# EAGLE design 8-Bit Register_New (EAGLE 7.5.0)
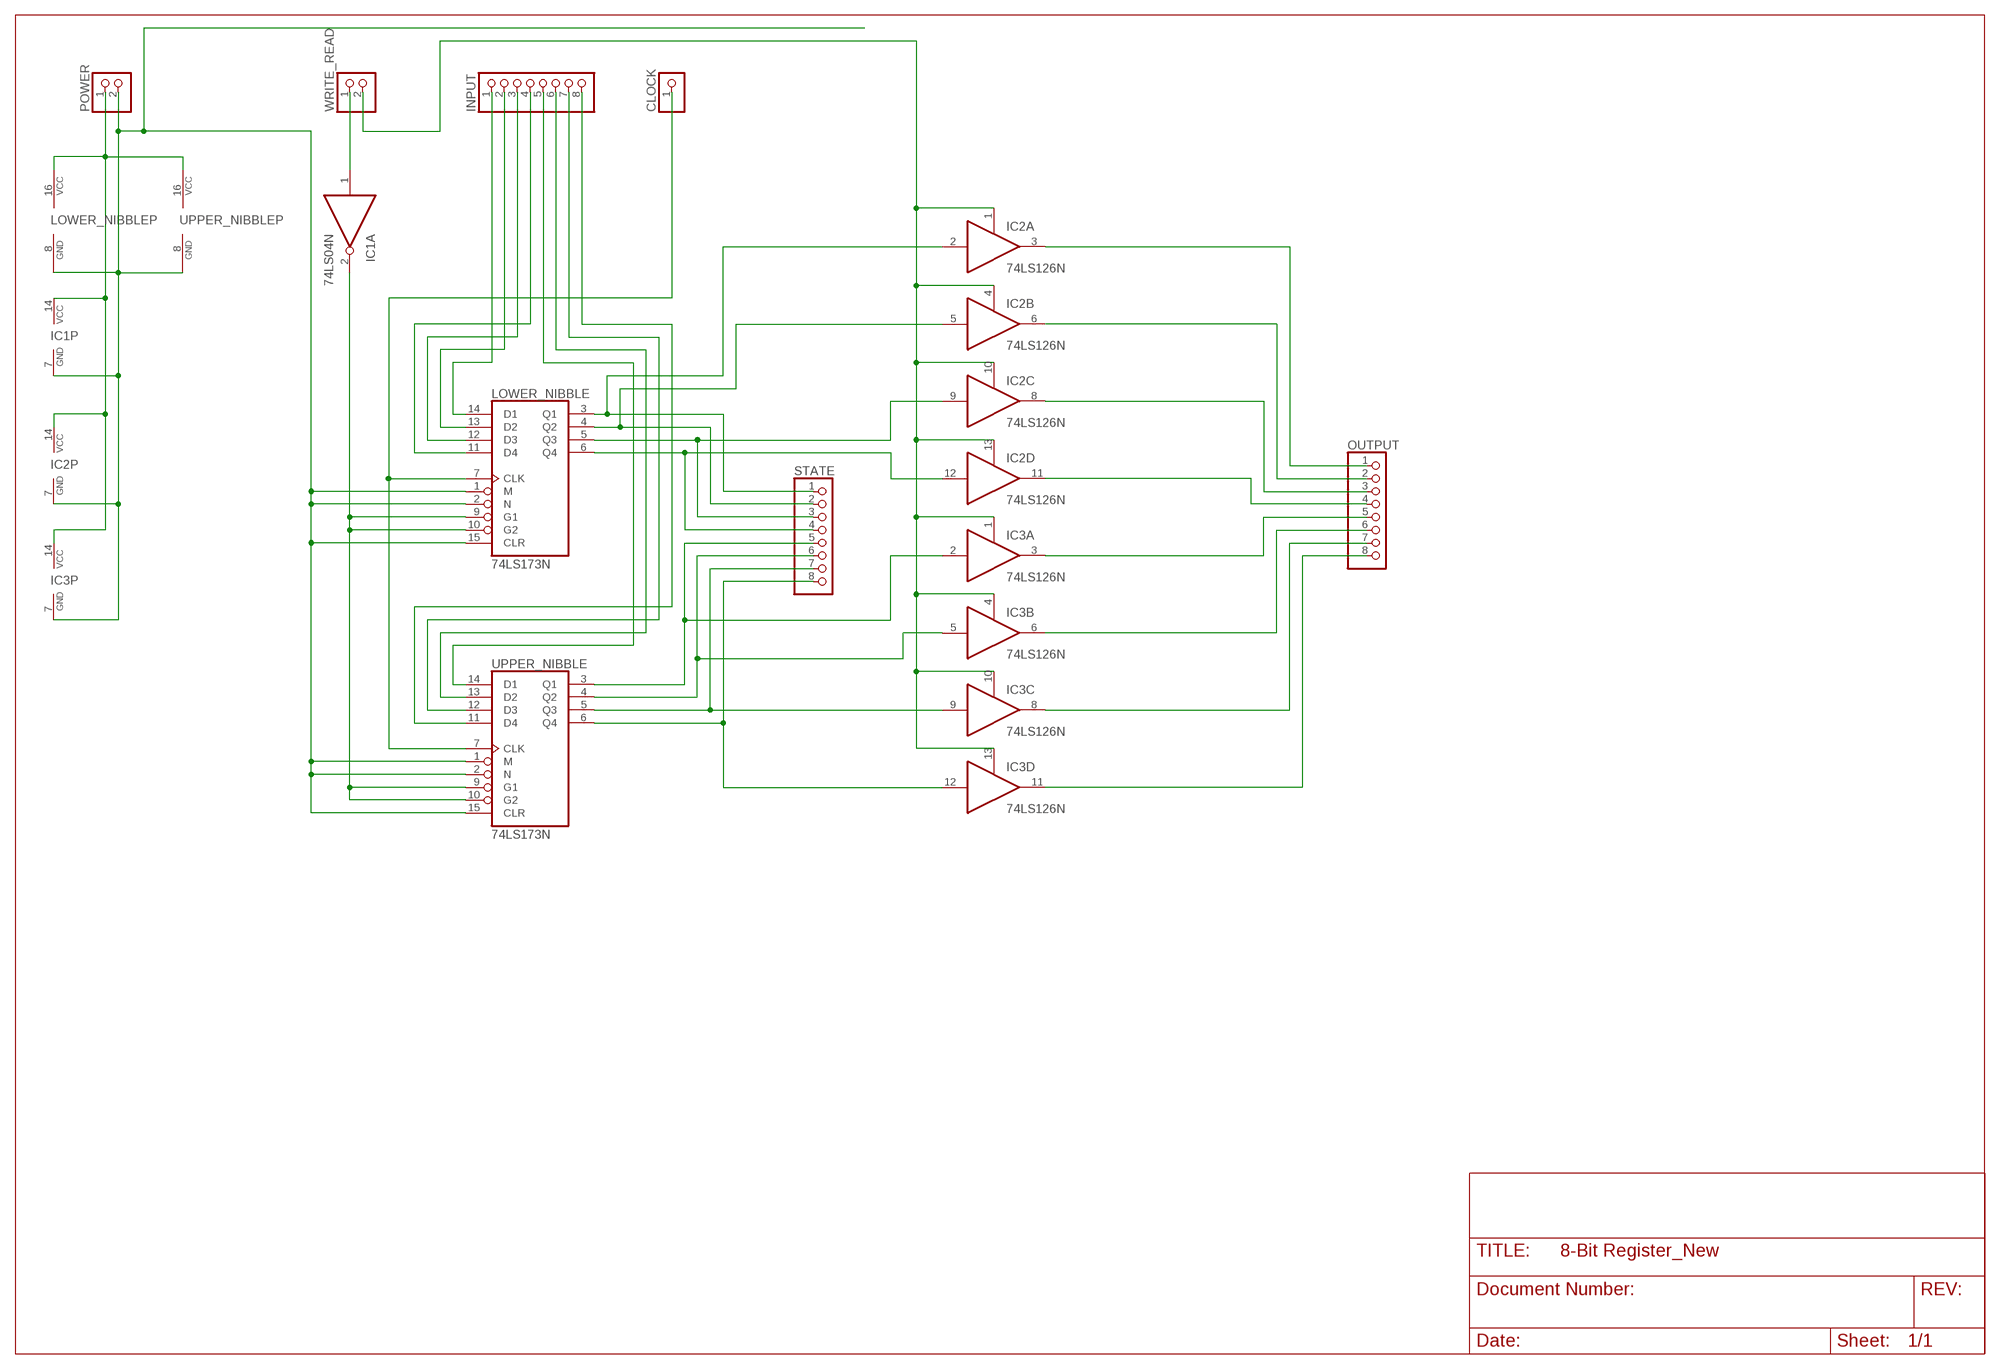
[diagram p0: schematic, sheet 1]

## Parts
CLOCK  PINHD-1X1  [1X01]
IC1  74LS04N  [DIL14]
IC2  74LS126N  [DIL14]
IC3  74LS126N  [DIL14]
INPUT  PINHD-1X8  [1X08]
LOWER_NIBBLE  74LS173N  [DIL16]
OUTPUT  PINHD-1X8  [1X08]
POWER  PINHD-1X2  [1X02]
STATE  PINHD-1X8  [1X08]
UPPER_NIBBLE  74LS173N  [DIL16]
WRITE_READ  PINHD-1X2  [1X02]

## Nets
GND: IC1.7(P:GND) IC2.7(P:GND) IC3.7(P:GND) LOWER_NIBBLE.1(M) LOWER_NIBBLE.2(N) LOWER_NIBBLE.8(GND) LOWER_NIBBLE.15(CLR) POWER.2 UPPER_NIBBLE.1(M) UPPER_NIBBLE.2(N) UPPER_NIBBLE.8(GND) UPPER_NIBBLE.15(CLR)
N$1: IC2.12(D:I) LOWER_NIBBLE.6(Q4) STATE.4
N$2: IC1.1(A:I) WRITE_READ.1
N$3: IC3.9(C:I) STATE.7 UPPER_NIBBLE.5(Q3)
N$11: IC2.11(D:O) OUTPUT.4
N$12: IC1.2(A:O) LOWER_NIBBLE.9(G1) LOWER_NIBBLE.10(G2) UPPER_NIBBLE.9(G1) UPPER_NIBBLE.10(G2)
N$13: CLOCK.1 LOWER_NIBBLE.7(CLK) UPPER_NIBBLE.7(CLK)
N$14: INPUT.1 LOWER_NIBBLE.14(D1)
N$15: INPUT.2 LOWER_NIBBLE.13(D2)
N$16: INPUT.3 LOWER_NIBBLE.12(D3)
N$17: INPUT.4 LOWER_NIBBLE.11(D4)
N$18: INPUT.6 UPPER_NIBBLE.13(D2)
N$19: INPUT.5 UPPER_NIBBLE.14(D1)
N$20: INPUT.7 UPPER_NIBBLE.12(D3)
N$21: INPUT.8 UPPER_NIBBLE.11(D4)
N$22: IC2.2(A:I) LOWER_NIBBLE.3(Q1) STATE.1
N$23: IC2.5(B:I) LOWER_NIBBLE.4(Q2) STATE.2
N$24: IC2.9(C:I) LOWER_NIBBLE.5(Q3) STATE.3
N$26: IC3.2(A:I) STATE.5 UPPER_NIBBLE.3(Q1)
N$27: IC3.5(B:I) STATE.6 UPPER_NIBBLE.4(Q2)
N$29: IC3.12(D:I) STATE.8 UPPER_NIBBLE.6(Q4)
N$30: IC2.1(A:OE) IC2.4(B:OE) IC2.10(C:OE) IC2.13(D:OE) IC3.1(A:OE) IC3.4(B:OE) IC3.10(C:OE) IC3.13(D:OE) WRITE_READ.2
N$31: IC2.3(A:O) OUTPUT.1
N$32: IC2.6(B:O) OUTPUT.2
N$33: IC2.8(C:O) OUTPUT.3
N$35: IC3.3(A:O) OUTPUT.5
N$36: IC3.6(B:O) OUTPUT.6
N$37: IC3.8(C:O) OUTPUT.7
N$38: IC3.11(D:O) OUTPUT.8
VCC: IC1.14(P:VCC) IC2.14(P:VCC) IC3.14(P:VCC) LOWER_NIBBLE.16(VCC) POWER.1 UPPER_NIBBLE.16(VCC)
Unconnected: IC1.3(B:I) IC1.4(B:O) IC1.5(C:I) IC1.6(C:O) IC1.8(D:O) IC1.9(D:I) IC1.10(E:O) IC1.11(E:I) IC1.12(F:O) IC1.13(F:I)

## Library data of the parts
CLOCK = pinhead:PINHD-1X1: PIN HEADER
IC1 = 74xx-eu:74*04: Hex INVERTER
IC2 IC3 = 74xx-eu:74*126: Quad bus BUFFER, 3-state
INPUT OUTPUT STATE = pinhead:PINHD-1X8: PIN HEADER
LOWER_NIBBLE UPPER_NIBBLE = 74xx-us:74*173: 4-bit D type REGISTER, 3-state
POWER WRITE_READ = pinhead:PINHD-1X2: PIN HEADER

## Board
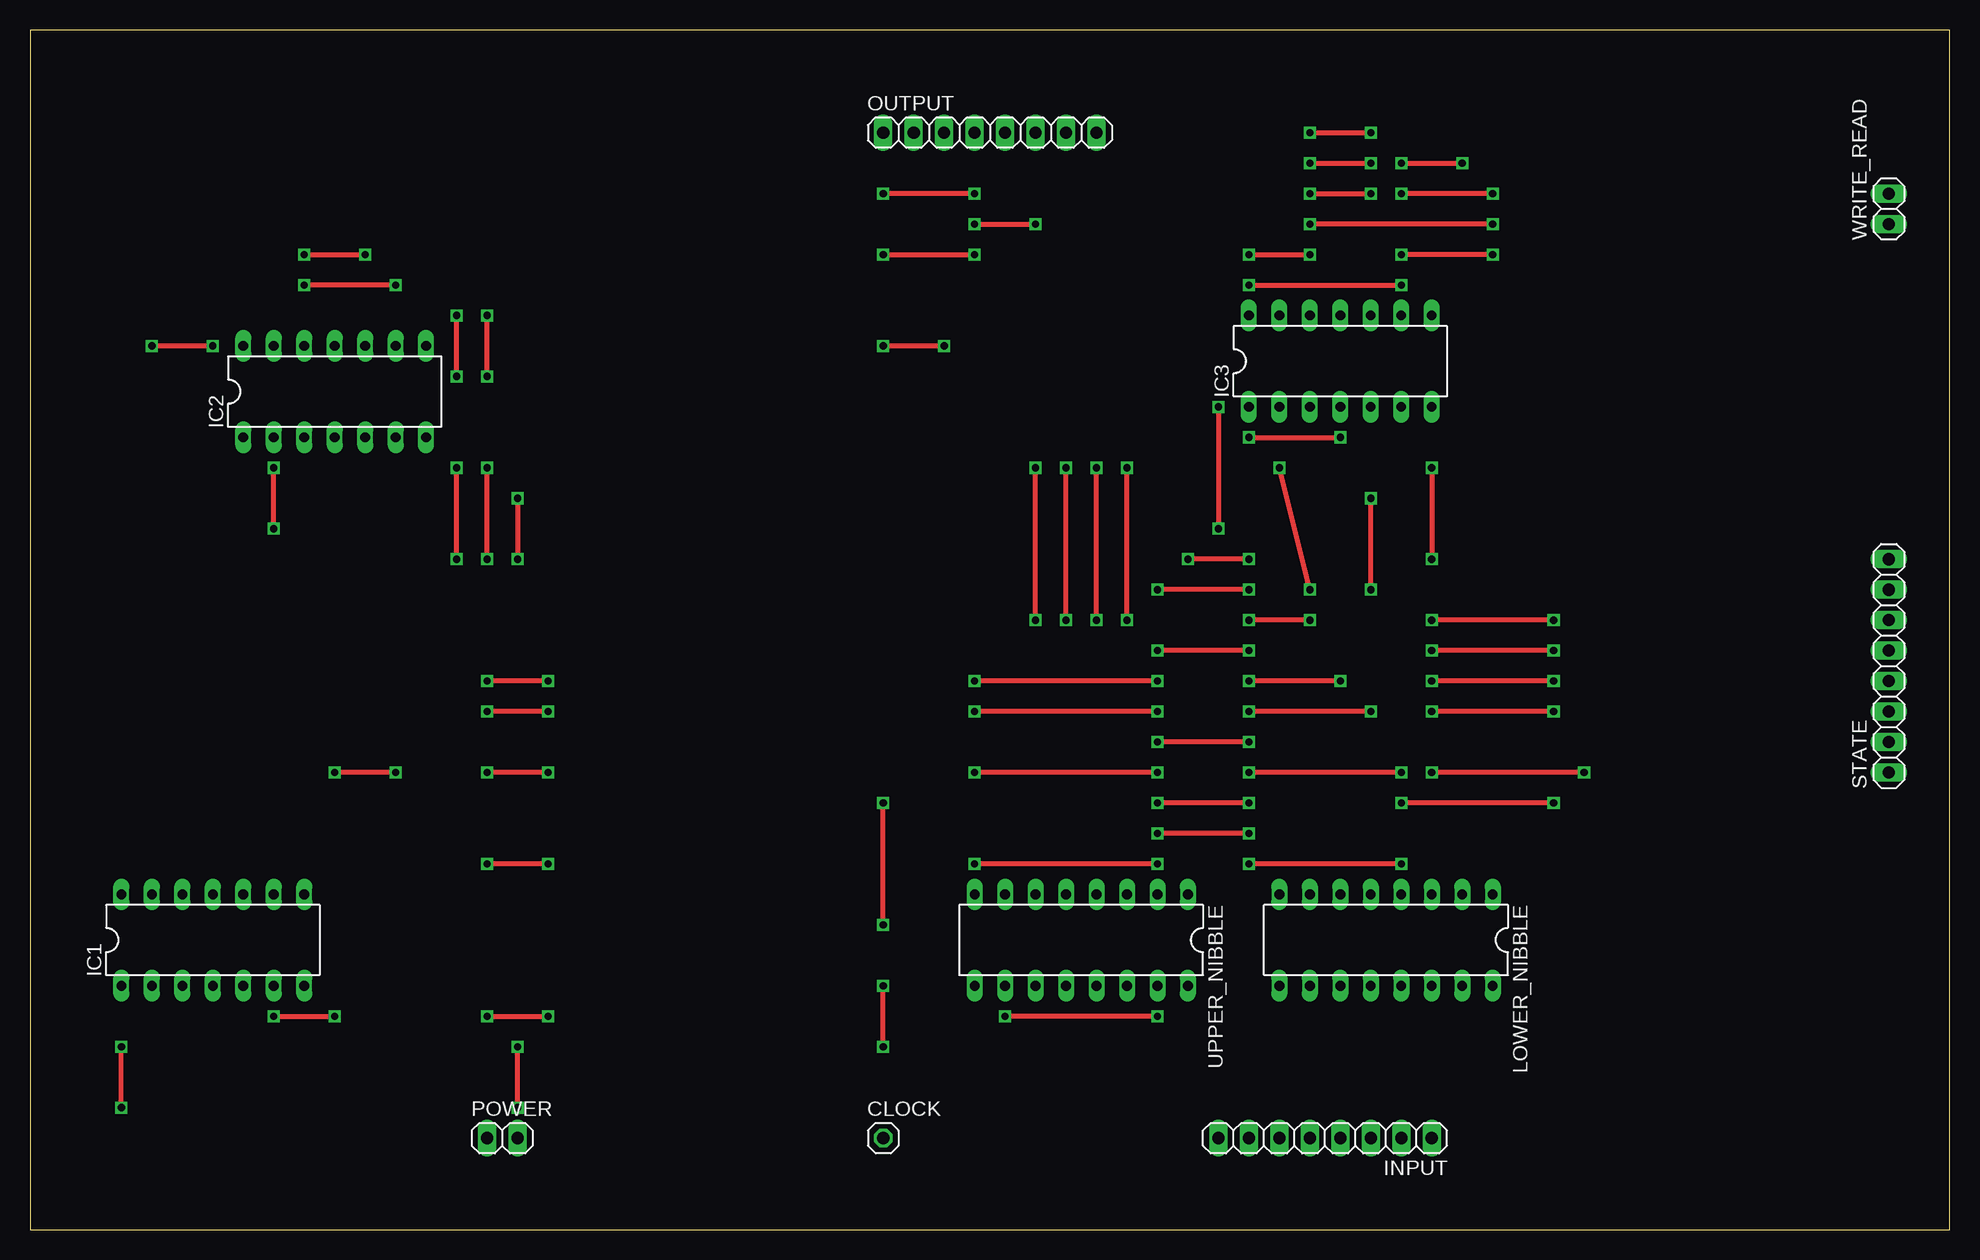
[diagram p1: board, top side]
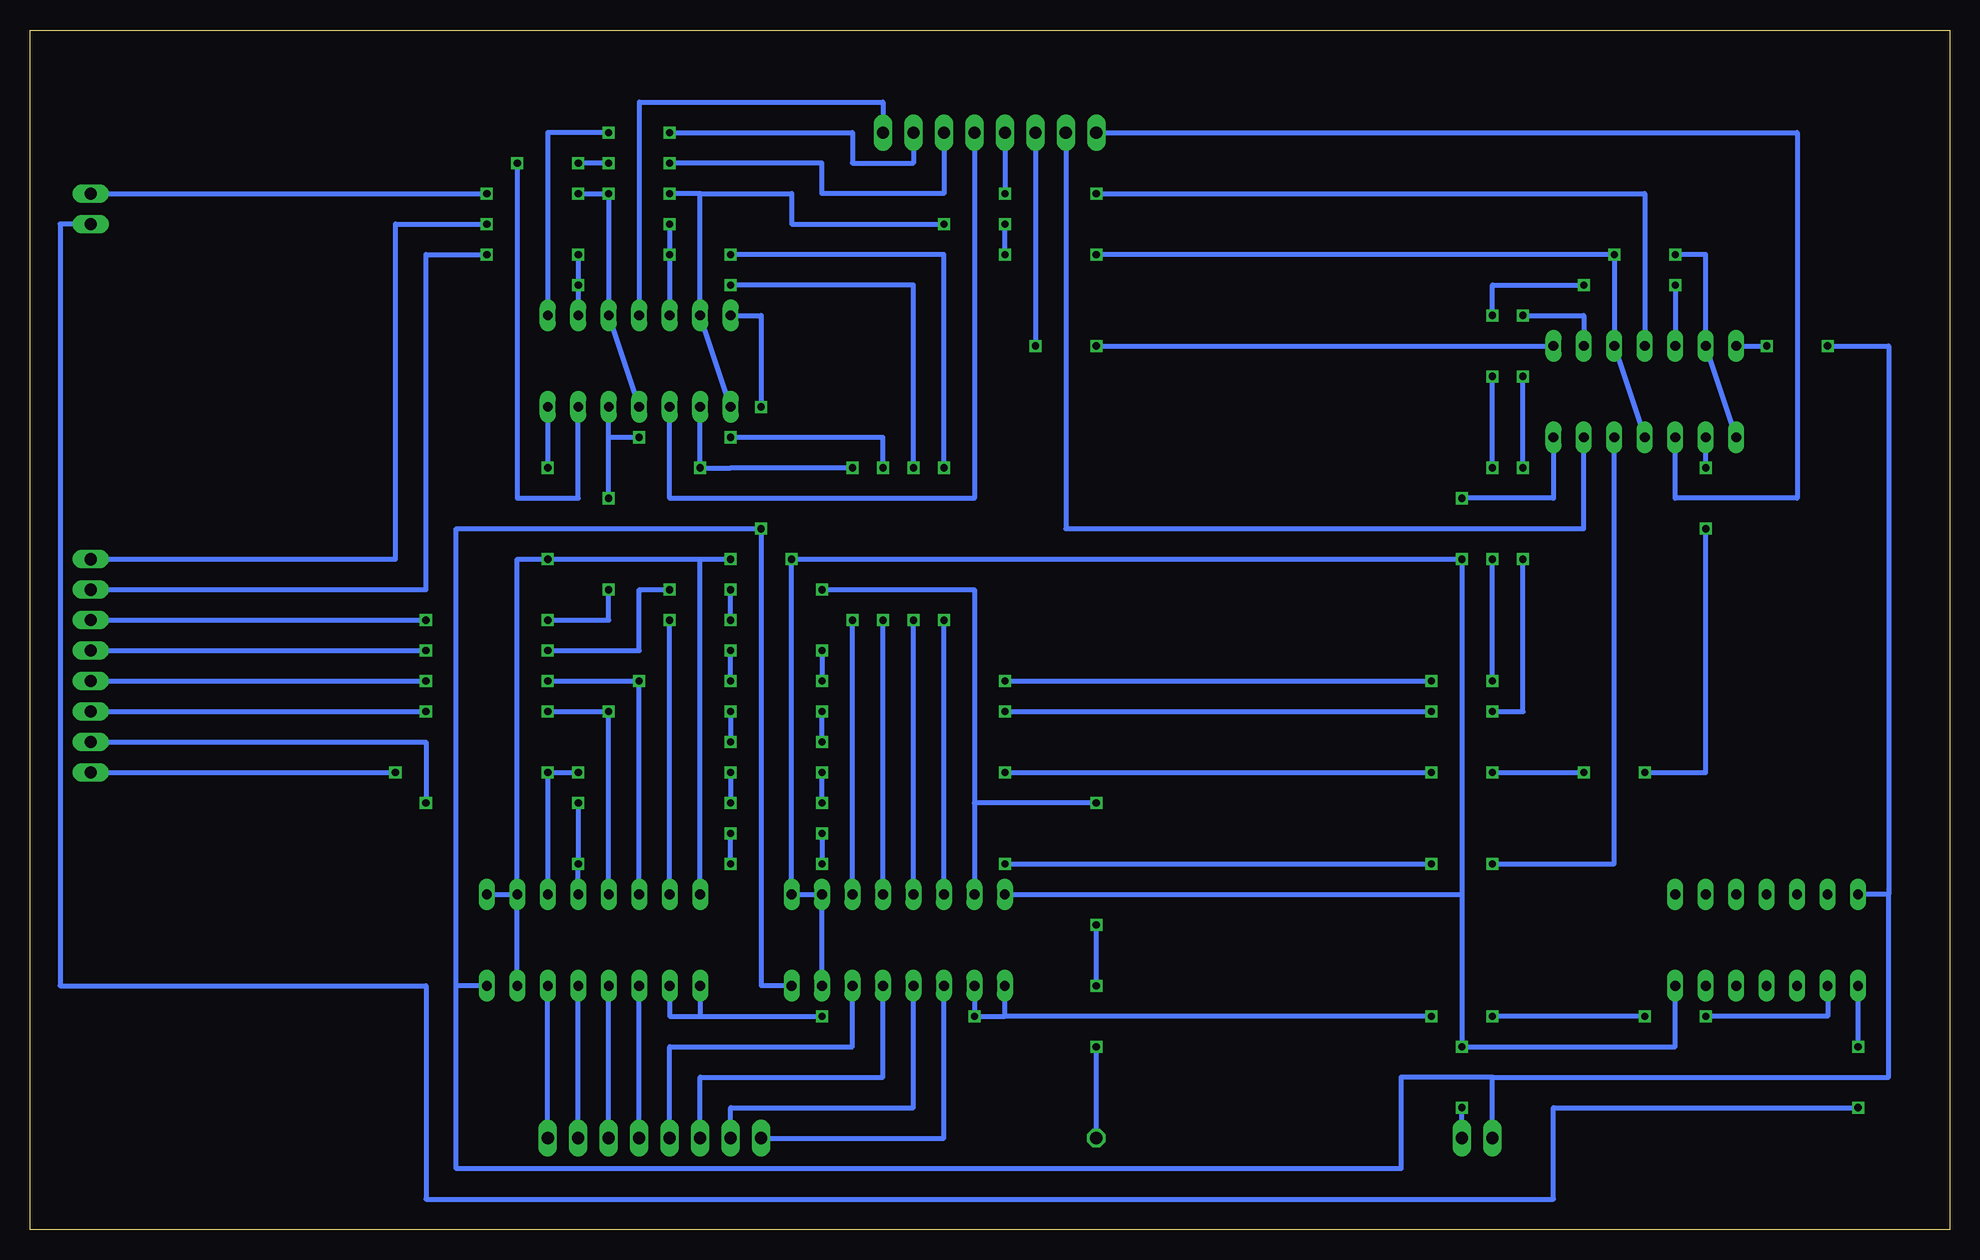
[diagram p2: board, bottom side, seen from below]

Size 160 x 100 mm. Coordinates in mm from the lower left corner, seen from the top.
Outline: 0,0 160,0 160,100 0,100 0,0
Copper layers (1*16): Top 0.035mm / dielectric 1.5mm / Bottom 0.035mm
Design rules "default": minimum track width 10mil, minimum drill 24mil, track to track 8mil, track to pad 8mil, pad to pad 8mil, via to via 8mil, smd to smd 8mil, copper to edge 40mil, drill to drill 8mil, minimum pad ring 10mil, minimum via ring 8mil, stop-mask expansion 4mil, vias tented up to drill 0mil, thermal gap 10mil

### Footprints (pad centres in the part's own frame; a part is rotated, then mirrored left to right if it is on the bottom)
1X01 = drill 1.016 octagon: 1 0,0
DIL14 = drill 0.813 long: 1 -7.62,-3.81; 2 -5.08,-3.81; 3 -2.54,-3.81; 4 0,-3.81; 5 2.54,-3.81; 6 5.08,-3.81; 7 7.62,-3.81; 8 7.62,3.81; 9 5.08,3.81; 10 2.54,3.81; 11 0,3.81; 12 -2.54,3.81; 13 -5.08,3.81; 14 -7.62,3.81
1X08 = drill 1.016 long: 1 -8.89,0; 2 -6.35,0; 3 -3.81,0; 4 -1.27,0; 5 1.27,0; 6 3.81,0; 7 6.35,0; 8 8.89,0
DIL16 = drill 0.813 long: 1 -8.89,-3.81; 2 -6.35,-3.81; 3 -3.81,-3.81; 4 -1.27,-3.81; 5 1.27,-3.81; 6 3.81,-3.81; 7 6.35,-3.81; 8 8.89,-3.81; 9 8.89,3.81; 10 6.35,3.81; 11 3.81,3.81; 12 1.27,3.81; 13 -1.27,3.81; 14 -3.81,3.81; 15 -6.35,3.81; 16 -8.89,3.81
1X02 = drill 1.016 long: 1 -1.27,0; 2 1.27,0

### Placement (x,y rotation side)
CLOCK  71.12,7.62 0 top
IC1  15.24,24.13 0 top
IC2  25.4,69.85 0 top
IC3  109.22,72.39 0 top
INPUT  107.95,7.62 180 top
LOWER_NIBBLE  113.03,24.13 180 top
OUTPUT  80.01,91.44 0 top
POWER  39.37,7.62 0 top
STATE  154.94,46.99 90 top
UPPER_NIBBLE  87.63,24.13 180 top
WRITE_READ  154.94,85.09 90 top

### Tracks (layer width: path | path; a pad name or v marks a point on that pad's centre or on a via)
GND  (via drill 0.6)
  Top 0.406: v40.64,10.16 v40.64,15.24 | v116.84,63.5 v116.84,55.88 | v101.6,55.88 v96.52,55.88 | v40.64,60.96 v40.64,55.88
  Bottom 0.406: POWER.2 v40.64,10.16 | IC1.7 22.86,15.24 v40.64,15.24 40.64,27.94 | UPPER_NIBBLE.8 40.64,27.94 | IC3.7 v116.84,63.5 | 104.14,55.88 v116.84,55.88 119.38,55.88 LOWER_NIBBLE.2 | 104.14,55.88 v101.6,55.88 | 40.64,27.94 v40.64,55.88 v96.52,55.88 UPPER_NIBBLE.1 UPPER_NIBBLE.2 UPPER_NIBBLE.15 | IC2.7 33.02,60.96 v40.64,60.96 | LOWER_NIBBLE.15 LOWER_NIBBLE.2 | LOWER_NIBBLE.1 LOWER_NIBBLE.2 | LOWER_NIBBLE.8 104.14,55.88
N$1  (via drill 0.6)
  Top 0.406: v109.22,45.72 v101.6,45.72 | v101.6,48.26 v93.98,48.26 | v93.98,45.72 v78.74,45.72 | v43.18,45.72 v38.1,45.72 | v38.1,55.88 v38.1,63.5 | v38.1,71.12 v38.1,76.2 | v30.48,78.74 v22.86,78.74 | v127,45.72 v116.84,45.72
  Bottom 0.406: LOWER_NIBBLE.6 v109.22,45.72 v116.84,45.72 | v101.6,45.72 v101.6,48.26 | v93.98,48.26 v93.98,45.72 | v78.74,45.72 v43.18,45.72 | v38.1,45.72 v38.1,55.88 | v38.1,63.5 v38.1,71.12 | v38.1,76.2 38.1,78.74 v30.48,78.74 | v22.86,78.74 IC2.12 | STATE.4 v127,45.72
N$2  (via drill 0.6)
  Top 0.406: v7.62,10.16 v7.62,15.24
  Bottom 0.406: WRITE_READ.1 157.48,83.82 157.48,20.32 127,20.32 127,2.54 33.02,2.54 33.02,10.16 v7.62,10.16 | v7.62,15.24 IC1.1
N$3  (via drill 0.6)
  Top 0.406: v86.36,50.8 v86.36,63.5 | v101.6,78.74 v114.3,78.74 | v121.92,81.28 v114.3,81.28
  Bottom 0.406: UPPER_NIBBLE.5 v86.36,50.8 | v86.36,63.5 86.36,78.74 v101.6,78.74 | IC3.9 v114.3,78.74 v114.3,81.28 | STATE.7 127,53.34 127,81.28 v121.92,81.28
N$11  (via drill 0.6)
  Top 0.406: v78.74,86.36 v71.12,86.36
  Bottom 0.406: OUTPUT.4 v78.74,86.36 | v71.12,86.36 25.4,86.36 IC2.11
N$12  (via drill 0.6)
  Top 0.406: v20.32,17.78 v25.4,17.78 | v38.1,17.78 v43.18,17.78 | v93.98,17.78 v81.28,17.78
  Bottom 0.406: IC1.2 10.16,17.78 v20.32,17.78 | v25.4,17.78 v38.1,17.78 | v43.18,17.78 78.74,17.78 | 78.74,17.78 UPPER_NIBBLE.9 | UPPER_NIBBLE.10 v81.28,17.78 78.74,17.78 | LOWER_NIBBLE.9 104.14,17.78 | 104.14,17.78 v93.98,17.78 | LOWER_NIBBLE.10 106.68,17.78 104.14,17.78
N$13  (via drill 0.6)
  Top 0.406: v71.12,15.24 v71.12,20.32 | v71.12,25.4 v71.12,35.56 | v106.68,50.8 v101.6,50.8 | v101.6,53.34 v93.98,53.34
  Bottom 0.406: CLOCK.1 v71.12,15.24 | v71.12,20.32 v71.12,25.4 | v71.12,35.56 81.28,35.56 | 81.28,35.56 UPPER_NIBBLE.7 | LOWER_NIBBLE.7 v106.68,50.8 | v101.6,50.8 v101.6,53.34 | v93.98,53.34 81.28,53.34 81.28,35.56
N$14
  Bottom 0.406: INPUT.1 LOWER_NIBBLE.14
N$15
  Bottom 0.406: INPUT.2 LOWER_NIBBLE.13
N$16
  Bottom 0.406: INPUT.3 LOWER_NIBBLE.12
N$17
  Bottom 0.406: INPUT.4 LOWER_NIBBLE.11
N$18
  Bottom 0.406: INPUT.6 104.14,12.7 88.9,12.7 UPPER_NIBBLE.13
N$19
  Bottom 0.406: INPUT.5 106.68,15.24 91.44,15.24 UPPER_NIBBLE.14
N$20
  Bottom 0.406: INPUT.7 101.6,10.16 86.36,10.16 UPPER_NIBBLE.12
N$21
  Bottom 0.406: INPUT.8 83.82,7.62 UPPER_NIBBLE.11
N$22  (via drill 0.6)
  Top 0.406: v114.3,38.1 v101.6,38.1 | v101.6,35.56 v93.98,35.56 | v93.98,38.1 v78.74,38.1 | v43.18,38.1 v38.1,38.1 | v30.48,38.1 v25.4,38.1 | v20.32,58.42 v20.32,63.5 | v129.54,38.1 v116.84,38.1
  Bottom 0.406: v114.3,38.1 v116.84,38.1 LOWER_NIBBLE.3 | v101.6,38.1 v101.6,35.56 | v93.98,35.56 v93.98,38.1 | v78.74,38.1 v43.18,38.1 | v38.1,38.1 v30.48,38.1 | v25.4,38.1 20.32,38.1 v20.32,58.42 | v20.32,63.5 IC2.2 | STATE.1 v129.54,38.1
N$23  (via drill 0.6)
  Top 0.406: v114.3,30.48 v101.6,30.48 | v101.6,33.02 v93.98,33.02 | v93.98,30.48 v78.74,30.48 | v43.18,30.48 v38.1,30.48 | v127,35.56 v114.3,35.56
  Bottom 0.406: LOWER_NIBBLE.4 v114.3,30.48 v114.3,35.56 | v101.6,30.48 v101.6,33.02 | v93.98,33.02 v93.98,30.48 | v78.74,30.48 v43.18,30.48 | v38.1,30.48 27.94,30.48 IC2.5 | STATE.2 127,40.64 v127,35.56
N$24  (via drill 0.6)
  Top 0.406: v111.76,43.18 v101.6,43.18 | v101.6,40.64 v93.98,40.64 | v93.98,43.18 v78.74,43.18 | v43.18,43.18 v38.1,43.18 | v35.56,55.88 v35.56,63.5 | v35.56,71.12 v35.56,76.2 | v127,43.18 v116.84,43.18
  Bottom 0.406: LOWER_NIBBLE.5 v111.76,43.18 v116.84,43.18 | v101.6,43.18 v101.6,40.64 | v93.98,40.64 v93.98,43.18 | v78.74,43.18 v43.18,43.18 | v38.1,43.18 35.56,43.18 v35.56,55.88 | v35.56,63.5 v35.56,71.12 | v35.56,76.2 30.48,76.2 IC2.9 | STATE.3 v127,43.18
N$26  (via drill 0.6)
  Top 0.406: v91.44,50.8 v91.44,63.5 | v127,48.26 v116.84,48.26 | v106.68,53.34 v104.14,63.5
  Bottom 0.406: UPPER_NIBBLE.3 v91.44,50.8 | v91.44,63.5 101.6,63.5 v104.14,63.5 IC3.2 | STATE.5 v127,48.26 | v116.84,48.26 109.22,48.26 109.22,53.34 v106.68,53.34
N$27  (via drill 0.6)
  Top 0.406: v88.9,50.8 v88.9,63.5 | v101.6,66.04 v109.22,66.04 | v127,50.8 v116.84,50.8 | v111.76,53.34 v111.76,60.96
  Bottom 0.406: UPPER_NIBBLE.4 v88.9,50.8 | v88.9,63.5 88.9,66.04 v101.6,66.04 | v109.22,66.04 111.76,66.04 | 111.76,66.04 IC3.5 | STATE.6 v127,50.8 | v116.84,50.8 111.76,50.8 v111.76,53.34 | v111.76,60.96 111.76,66.04
N$29  (via drill 0.6)
  Top 0.406: v83.82,50.8 v83.82,63.5 | v101.6,81.28 v106.68,81.28 | v121.92,83.82 v106.68,83.82
  Bottom 0.406: UPPER_NIBBLE.6 v83.82,50.8 | v83.82,63.5 83.82,81.28 v101.6,81.28 | IC3.12 v106.68,81.28 v106.68,83.82 | STATE.8 129.54,55.88 129.54,83.82 v121.92,83.82
N$30  (via drill 0.6)
  Top 0.406: v121.92,86.36 v114.3,86.36 | v106.68,86.36 v111.76,86.36 | v71.12,81.28 v78.74,81.28 | v78.74,83.82 v83.82,83.82 | v22.86,81.28 v27.94,81.28
  Bottom 0.406: WRITE_READ.2 v121.92,86.36 | v114.3,86.36 v111.76,86.36 IC3.10 IC3.4 | 104.14,86.36 IC3.13 IC3.1 | 104.14,86.36 v106.68,86.36 | v71.12,81.28 v27.94,81.28 IC2.10 IC2.4 | v78.74,81.28 v78.74,83.82 | v22.86,81.28 20.32,81.28 IC2.13 IC2.1 | 104.14,86.36 96.52,86.36 96.52,83.82 v83.82,83.82
N$31
  Bottom 0.406: OUTPUT.1 12.7,91.44 12.7,60.96 22.86,60.96 IC2.3
N$32
  Bottom 0.406: OUTPUT.2 73.66,58.42 30.48,58.42 IC2.6
N$33  (via drill 0.6)
  Top 0.406: v76.2,73.66 v71.12,73.66
  Bottom 0.406: OUTPUT.3 v76.2,73.66 | v71.12,73.66 IC2.8
N$35
  Bottom 0.406: OUTPUT.5 81.28,60.96 106.68,60.96 IC3.3
N$36  (via drill 0.6)
  Top 0.406: v106.68,88.9 v111.76,88.9 | v114.3,88.9 v119.38,88.9
  Bottom 0.406: OUTPUT.6 83.82,86.36 93.98,86.36 93.98,88.9 v106.68,88.9 | v111.76,88.9 v114.3,88.9 | v119.38,88.9 119.38,60.96 114.3,60.96 IC3.6
N$37  (via drill 0.6)
  Top 0.406: v106.68,91.44 v111.76,91.44
  Bottom 0.406: OUTPUT.7 86.36,88.9 91.44,88.9 91.44,91.44 v106.68,91.44 | v111.76,91.44 116.84,91.44 IC3.8
N$38
  Bottom 0.406: IC3.11 109.22,93.98 88.9,93.98 OUTPUT.8
VCC  (via drill 0.6)
  Top 0.406: v15.24,73.66 v10.16,73.66 | v99.06,68.58 v99.06,58.42
  Bottom 0.406: POWER.1 38.1,12.7 | 38.1,12.7 5.08,12.7 5.08,27.94 | 5.08,27.94 IC1.14 | IC2.14 v15.24,73.66 | v10.16,73.66 5.08,73.66 5.08,27.94 | IC3.14 99.06,76.2 v99.06,68.58 | UPPER_NIBBLE.16 99.06,20.32 v99.06,58.42 124.46,58.42 124.46,20.32 | LOWER_NIBBLE.16 124.46,20.32 | 38.1,12.7 45.72,12.7 45.72,5.08 124.46,5.08 124.46,20.32